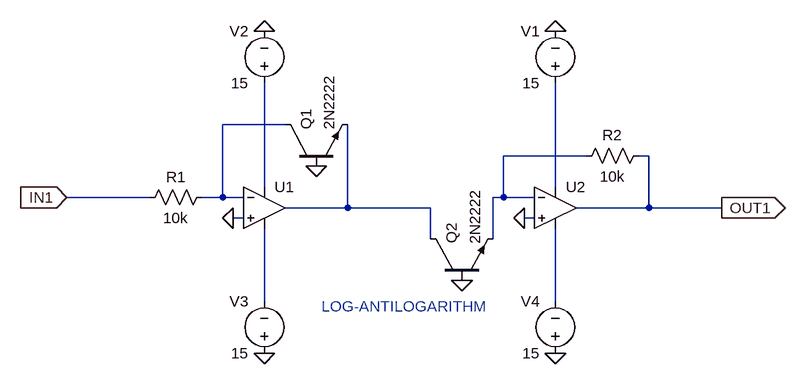
[diagram p0: schematic logantilogblock.asc]
logantilogblock.asc, the LTspice schematic file:
Version 4.1
SHEET 1 940 680
WIRE 144 64 48 64
WIRE 608 112 480 112
WIRE 704 112 688 112
WIRE 112 160 112 0
WIRE 560 160 560 0
WIRE -64 176 -192 176
WIRE 48 176 48 64
WIRE 48 176 16 176
WIRE 80 176 48 176
WIRE 480 176 480 112
WIRE 480 176 464 176
WIRE 528 176 480 176
WIRE 240 192 240 64
WIRE 240 192 144 192
WIRE 368 192 240 192
WIRE 704 192 704 112
WIRE 704 192 592 192
WIRE 816 192 704 192
WIRE 80 208 64 208
WIRE 528 208 512 208
WIRE 368 240 368 192
WIRE 464 240 464 176
WIRE 112 336 112 224
WIRE 560 336 560 224
FLAG 112 -80 0
FLAG 560 -80 0
FLAG 560 416 0
FLAG 112 416 0
FLAG 64 208 0
FLAG 512 208 0
FLAG 192 128 0
FLAG 416 304 0
FLAG -192 176 IN1
IOPIN -192 176 In
FLAG 816 192 OUT1
IOPIN 816 192 Out
SYMBOL OpAmps\\UniversalOpAmp 112 192 R0
SYMATTR InstName U1
SYMBOL OpAmps\\UniversalOpAmp 560 192 R0
SYMATTR InstName U2
SYMBOL res 32 160 R90
WINDOW 0 0 56 VBottom 2
WINDOW 3 32 56 VTop 2
SYMATTR InstName R1
SYMATTR Value 10k
SYMBOL res 704 96 R90
WINDOW 0 0 56 VBottom 2
WINDOW 3 32 56 VTop 2
SYMATTR InstName R2
SYMATTR Value 10k
SYMBOL voltage 560 16 R180
WINDOW 0 24 96 Left 2
WINDOW 3 24 16 Left 2
WINDOW 123 0 0 Left 0
WINDOW 39 0 0 Left 0
SYMATTR InstName V1
SYMATTR Value 15
SYMBOL voltage 112 16 R180
WINDOW 0 24 96 Left 2
WINDOW 3 24 16 Left 2
WINDOW 123 0 0 Left 0
WINDOW 39 0 0 Left 0
SYMATTR InstName V2
SYMATTR Value 15
SYMBOL voltage 112 432 R180
WINDOW 0 24 96 Left 2
WINDOW 3 24 16 Left 2
WINDOW 123 0 0 Left 0
WINDOW 39 0 0 Left 0
SYMATTR InstName V3
SYMATTR Value 15
SYMBOL voltage 560 432 R180
WINDOW 0 24 96 Left 2
WINDOW 3 24 16 Left 2
WINDOW 123 0 0 Left 0
WINDOW 39 0 0 Left 0
SYMATTR InstName V4
SYMATTR Value 15
SYMBOL npn 144 128 R270
SYMATTR InstName Q1
SYMATTR Value 2N2222
SYMBOL npn 368 304 R270
SYMATTR InstName Q2
SYMATTR Value 2N2222
TEXT 200 344 Left 2 ;LOG-ANTILOGARITHM

The netlist it stands for:
* logantilogblock.asc
X§U1 0 N001 N003 N006 N005 level1 Avol=1Meg GBW=10Meg Vos=0 En=0 Enk=0 In=0 Ink=0 Rin=500Meg  ; pins In+ In- V+ V- OUT
X§U2 0 N002 N004 N007 OUT1 level1 Avol=1Meg GBW=10Meg Vos=0 En=0 Enk=0 In=0 Ink=0 Rin=500Meg  ; pins In+ In- V+ V- OUT
R1 N001 IN1 10k
R2 OUT1 N002 10k
V1 N004 0 15
V2 N003 0 15
V3 0 N006 15
V4 0 N007 15
Q1 N001 0 N005 0 2N2222
Q2 N005 0 N002 0 2N2222
.model NPN NPN
.model PNP PNP
.lib standard.bjt
* LOG-ANTILOGARITHM
.lib UniversalOpAmp1.lib
.backanno
.end